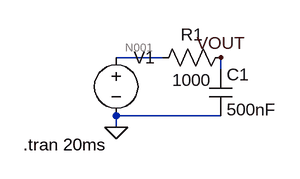
[diagram p0: schematic Ejercicio3(1).asc]
Ejercicio3(1).asc, the LTspice schematic file:
Version 4
SHEET 1 880 680
WIRE 64 160 0 160
WIRE 144 176 144 160
WIRE 144 240 0 240
WIRE 0 256 0 240
FLAG 0 256 0
FLAG 144 160 VOUT
SYMBOL voltage 0 144 R0
WINDOW 3 24 96 Invisible 2
WINDOW 123 0 0 Left 0
WINDOW 39 0 0 Left 0
SYMATTR Value SINE(0 5 10000 0 0 0 0)
SYMATTR InstName V1
SYMBOL res 160 144 R90
WINDOW 0 0 56 VBottom 2
WINDOW 3 32 56 VTop 2
SYMATTR InstName R1
SYMATTR Value 1000
SYMBOL cap 128 176 R0
SYMATTR InstName C1
SYMATTR Value 500nF
TEXT -128 280 Left 2 !.tran 20ms

The netlist it stands for:
* Ejercicio3(1).asc
V1 N001 0 SINE(0 5 10000 0 0 0 0)
R1 VOUT N001 1000
C1 VOUT 0 500nF
.tran 20ms
.backanno
.end

* Results of the author's LTspice run, read from the files saved beside the schematic
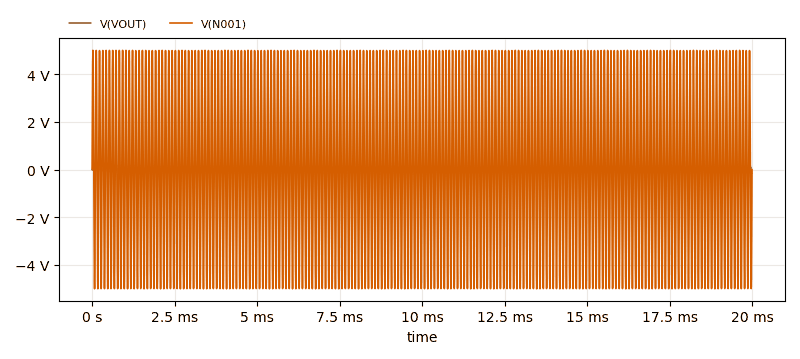
[diagram p1: Transient Analysis of Ejercicio3(1).asc, plotted from the saved traces]
* Transient Analysis, 1 run:
*   V(VOUT): min -157.9 mV, max 287.3 mV, average 3.714 mV, rms 106.7 mV, last -157.9 mV
*   V(N001): min -5 V, max 5 V, average -194.5 µV, rms 3.575 V, last 0 V